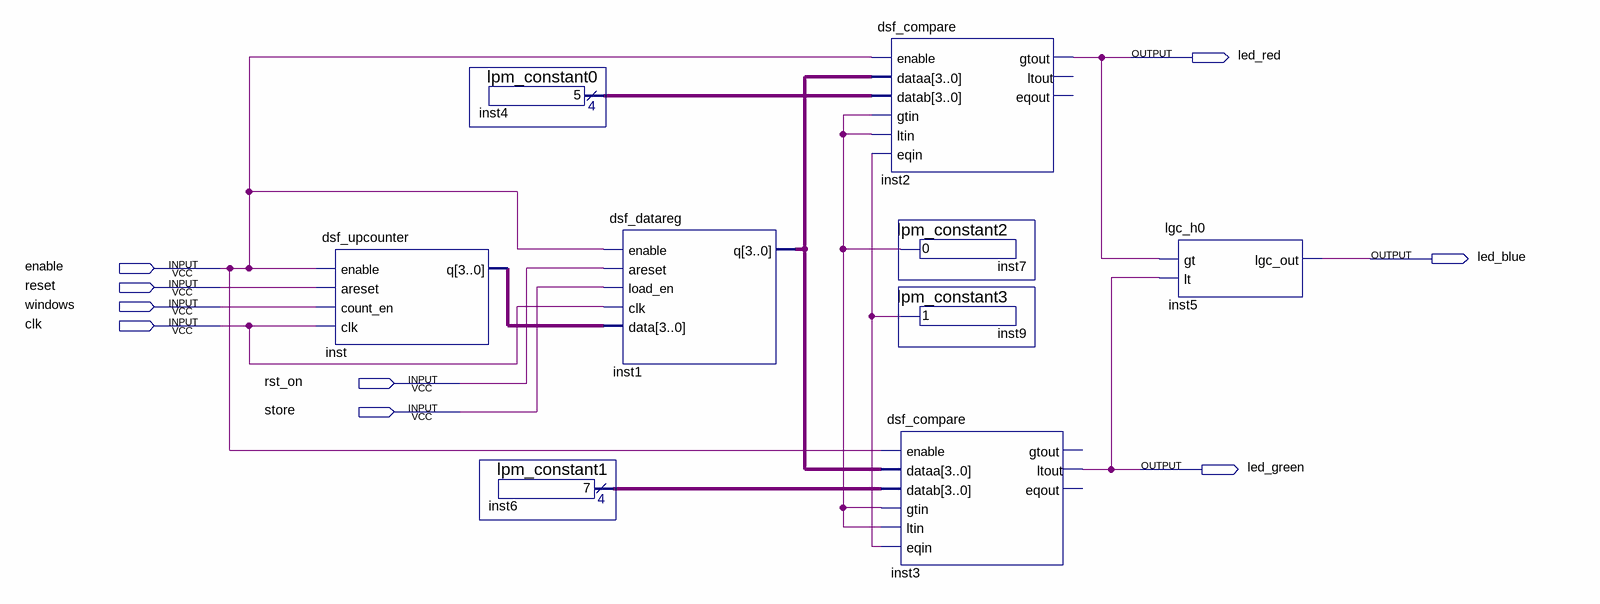
[diagram p0: schematic sheet]
// Quartus schematic schematic.bdf as structural Verilog: 9 symbols, 9 pins
module schematic (
  input  enable,
  input  reset,
  input  windows,
  input  clk,
  input  rst_on,
  input  store,
  output led_red,
  output led_blue,
  output led_green
);

  wire inst7_result, inst9_result;
  wire [3:0] inst1_q, inst4_result, inst6_result, inst_q;

  dsf_upcounter inst (.enable(enable), .areset(reset), .count_en(windows), .clk(clk), .q(inst_q));
  lpm_constant0 inst4 (.result(inst4_result));
  lpm_constant1 inst6 (.result(inst6_result));
  dsf_datareg inst1 (.enable(enable), .areset(rst_on), .load_en(store), .clk(clk), .data(inst_q), .q(inst1_q));
  dsf_compare inst2 (
    .enable(enable), .dataa(inst1_q), .datab(inst4_result), .gtin(inst7_result), .ltin(inst7_result),
    .eqin(inst9_result), .gtout(led_red));  // open: ltout, eqout
  lpm_constant2 inst7 (.result(inst7_result));
  lpm_constant3 inst9 (.result(inst9_result));
  dsf_compare inst3 (
    .enable(enable), .dataa(inst1_q), .datab(inst6_result), .gtin(inst7_result), .ltin(inst7_result),
    .eqin(inst9_result), .ltout(led_green));  // open: gtout, eqout
  lgc_h0 inst5 (.gt(led_red), .lt(led_green), .lgc_out(led_blue));
endmodule
